# EasyEDA schematic SCHEMATICS1.json
TITLE: Sheet_1; REV: 1.0; Date: 2020-07-05; Sheet: 1/1; Drawn By: GROUP 10 TASK 2; Company: CAPSTONE PROJECT EMBT
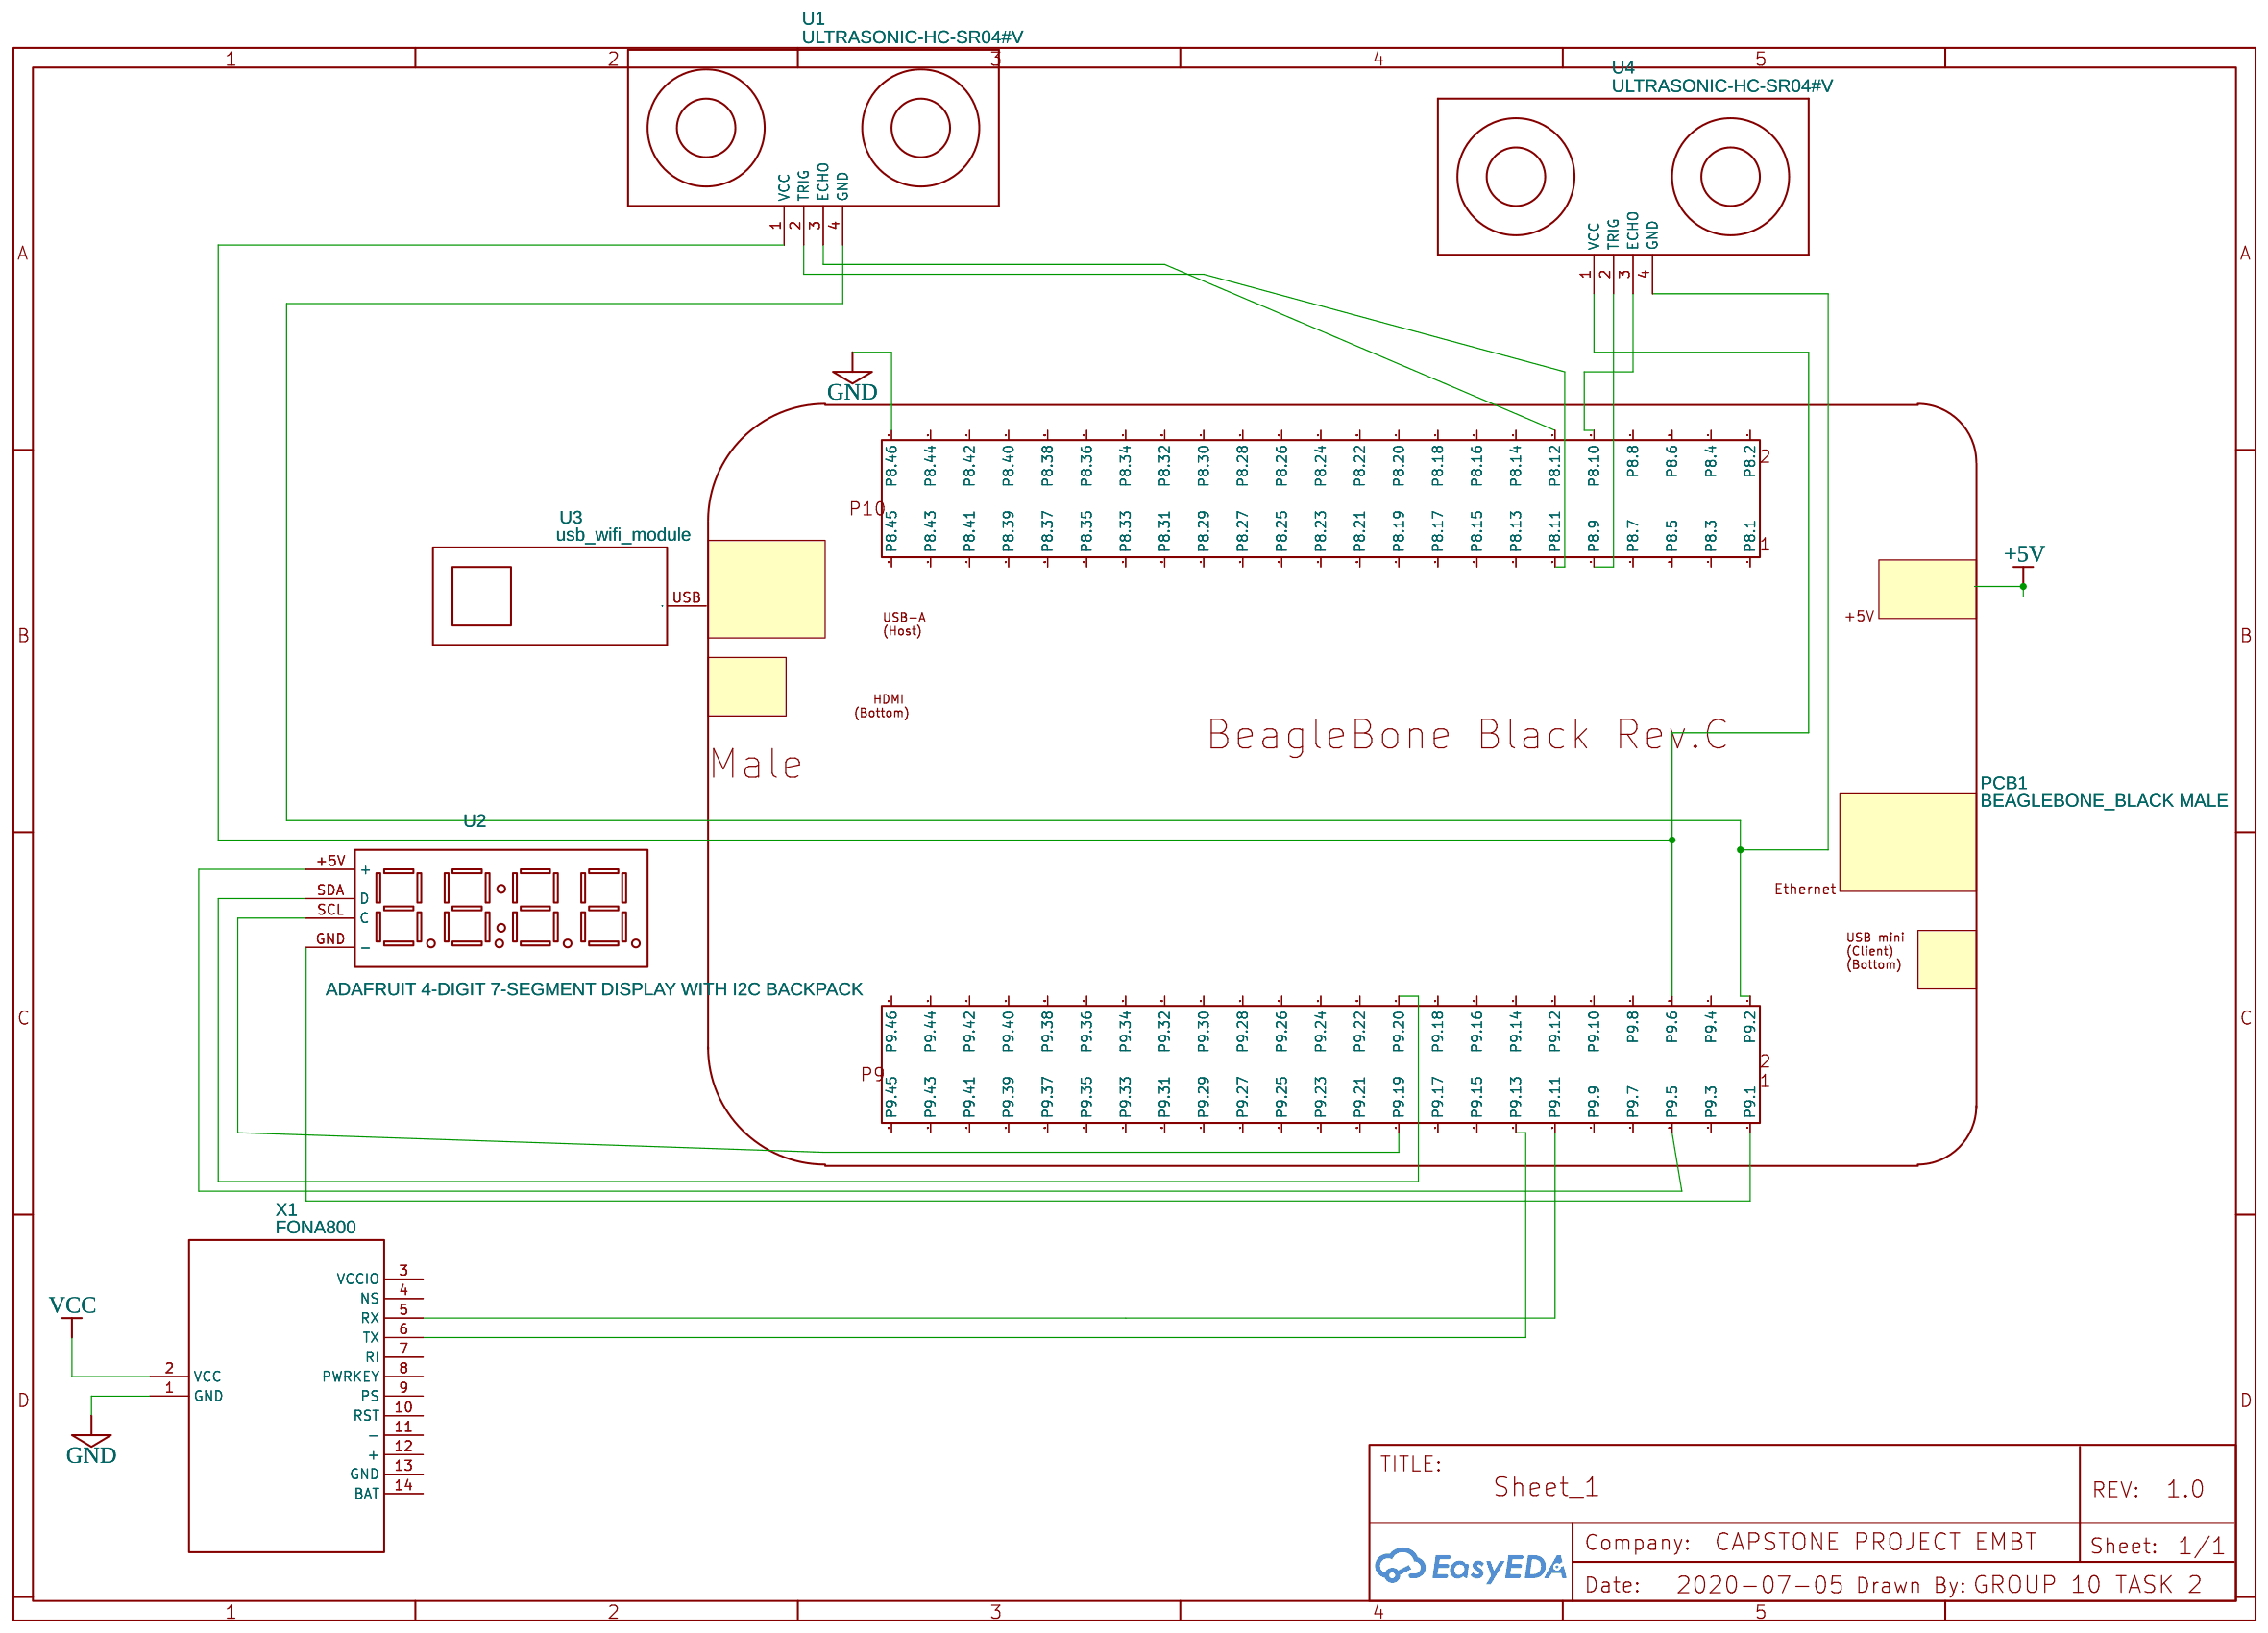
[diagram p0: schematic sheet]

## Parts
PCB1  BEAGLEBONE_BLACK MALE  [BEAGLEBONE_BLACK MALE]
U1  ULTRASONIC-HC-SR04#V  [ULTRASONIC-HC-SR04#V]
U2  ADAFRUIT 4-DIGIT 7-SEGMENT DISPLAY WITH I2C BACKPACK  [7-SEGMENT BACKPACK]
U3  usb_wifi_module
U4  ULTRASONIC-HC-SR04#V  [ULTRASONIC-HC-SR04#V]
X1  FONA800  [FONA800]

## Library data of the parts
PCB1 = BEAGLEBONE_BLACK MALE: Contributor: Nathanial Swearingen (Drac)
U1 U4 = ULTRASONIC-HC-SR04#V: Ultrasonic Ranging Module HC-SR04
U2 = ADAFRUIT 4-DIGIT 7-SEGMENT DISPLAY WITH I2C BACKPACK: Adafruit 7-Segment LED I2C Backpack
U3 = usb_wifi_module: Manufacturer Part: usb wifi module; Contributor: Flavio Bontà
X1 = FONA800: sourceId: 53XewqI0i

## Nets
GND: PCB1.P8.46 X1.1(GND)
VCC: X1.2(VCC)
Net-(PCB1-P8.9): PCB1.P8.9 U4.2(TRIG)
Net-(PCB1-P8.10): PCB1.P8.10 U4.3(ECHO)
Net-(PCB1-P8.11): PCB1.P8.11 U1.2(TRIG)
Net-(PCB1-P8.12): PCB1.P8.12 U1.3(ECHO)
Net-(PCB1-P9.1): PCB1.P9.1 U2.GND(-)
Net-(PCB1-P9.2): PCB1.P9.2 U1.4(GND) U4.4(GND)
Net-(PCB1-P9.5): PCB1.P9.5 U2.+5V(+)
Net-(PCB1-P9.6): PCB1.P9.6 U1.1(VCC) U4.1(VCC)
Net-(PCB1-P9.11): PCB1.P9.11 X1.5(RX)
Net-(PCB1-P9.13): PCB1.P9.13 X1.6(TX)
Net-(PCB1-P9.19): PCB1.P9.19 U2.SCL(C)
Net-(PCB1-P9.20): PCB1.P9.20 U2.SDA(D)

Not connected (* = marked no-connect by the designer): PCB1 P8.1 P8.2 P8.3 P8.4 P8.5 P8.6 P8.7 P8.8 P8.13 P8.14 P8.15 P8.16 P8.17 P8.18 P8.19 P8.20 P8.21 P8.22 P8.23 P8.24 P8.25 P8.26 P8.27 P8.28 P8.29 P8.30 P8.31 P8.32 P8.33 P8.34 P8.35 P8.36 P8.37 P8.38 P8.39 P8.40 P8.41 P8.42 P8.43 P8.44 P8.45 P9.3 P9.4 P9.7 P9.8 P9.9 P9.10 P9.12 P9.14 P9.15 P9.16 P9.17 P9.18 P9.21 P9.22 P9.23 P9.24 P9.25 P9.26 P9.27 P9.28 P9.29 P9.30 P9.31 P9.32 P9.33 P9.34 P9.35 P9.36 P9.37 P9.38 P9.39 P9.40 P9.41 P9.42 P9.43 P9.44 P9.45 P9.46; U3 USB(1); X1 3(VCCIO) 4(NS) 7(RI) 8(PWRKEY) 9(PS) 10(RST) 11(-) 12(+) 13(GND) 14(BAT)
